# Altium schematic sheet Integrated Connectors.SchDoc
size Letter
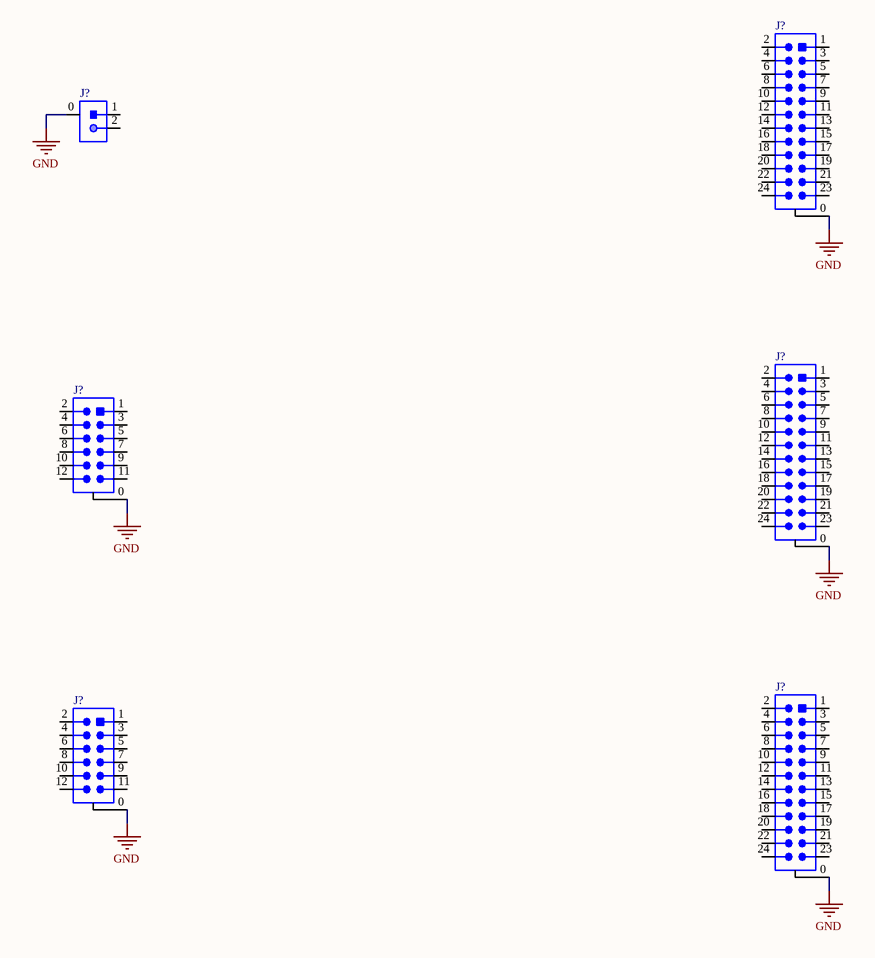
[diagram p0: Integrated Connectors.SchDoc]

## Parts
(Parts that share a designator on the sheet are numbered #1, #2 ... from top to bottom, then left to right.)
J?#1  CON_2M_SM_RA  [MOLEX-5024940270]  (value not drawn)
J?#2  CON_12x2M_SM_RA  [MOLEX-5031482490]  (value not drawn)
J?#3  CON_6x2M_SM_RA  [MOLEX-5031481290]  (value not drawn)
J?#4  CON_12x2M_SM_RA  [MOLEX-5031482490]  (value not drawn)
J?#5  CON_6x2M_SM_RA  [MOLEX-5031481290]  (value not drawn)
J?#6  CON_12x2M_SM_RA  [MOLEX-5031482490]  (value not drawn)

## Nets
GND: J?#1.0 J?#2.0 J?#3.0 J?#4.0 J?#5.0 J?#6.0

Not connected (* = marked no-connect by the designer): J?#1 1 2; J?#2 1 2 3 4 5 6 7 8 9 10 11 12 13 14 15 16 17 18 19 20 21 22 23 24; J?#3 1 2 3 4 5 6 7 8 9 10 11 12; J?#4 1 2 3 4 5 6 7 8 9 10 11 12 13 14 15 16 17 18 19 20 21 22 23 24; J?#5 1 2 3 4 5 6 7 8 9 10 11 12; J?#6 1 2 3 4 5 6 7 8 9 10 11 12 13 14 15 16 17 18 19 20 21 22 23 24

## Notes on the sheet
- Title
- Size:
- Date:
- Letter
- Drawn By:
- Sheet
- of
- File:

## Library data of the parts
J?#1 = CON_2M_SM_RA: CONN HEADER SMD RIGHT ANGLE 2MM PITCH; Manufacturer 1: Molex; Manufacturer Part Number 1: 5024940270; Connector Type: Receptacle,Forked; Number of Positions: 2; Supplier 1: Digi-Key; Stock 1: 3397; Pricing 1: 1=0.53000, 10=0.49400, 25=0.44440, 50=0.39500, 100=0.37850, 250=0.34556 (USD); RoHS: No; Mount: Surface Mount; Contact Plating: Tin; Insulation Color: Natural; Insulation Material: Resin; Min Operating Temperature: -40°C; Max Operating Temperature: 105°C; Fastening Type: Latch; Packaging: Tape and Reel; Number of Rows: 1; Termination: Solder; Flammability Rating: UL94 V-0; ComponentLink1URL: https://www.molex.com/pdm_docs/as/AS-502439-002-001.pdf?src-supplier=Digi-Key; ComponentLink1Description: https://www.molex.com/pdm_docs/as/AS-502439-002-001.pdf?src-supplier=Digi-Key; Supplier Part Number 1: WM15810CT-ND
J?#2 J?#4 J?#6 = CON_12x2M_SM_RA: CONN HEADER SMD RIGHT ANGLE 1.5MM PITCH
J?#3 J?#5 = CON_6x2M_SM_RA: CONN HEADER SMD RIGHT ANGLE 1.5MM PITCH; Manufacturer 1: Molex; Manufacturer Part Number 1: 5031481290; Number of Circuits: 12; Voltage Rating: 100V; Current Rating: 1A; Connector Type: Receptacle,Center Strip Contact; Gender: Receptacle; Glow Wire Compliant: Non-compliant; Supplier 1: Digi-Key; Stock 1: 276; Pricing 1: 1=1.86000, 10=1.68800, 100=1.44720 (USD); RoHS: Yes; Mount: Surface Mount,Through Hole; Contact Plating: Tin; Contact Material: Copper Alloy,Copper,Tin; Housing Color: Beige; Color: Beige; Housing Material: Resin; Min Operating Temperature: -25°C; Max Operating Temperature: 85°C; Packaging: Tape and Reel; Orientation: Right Angle; Number of Rows: 2; Package Quantity: 550; Fastening Type: Latch; Contact Gender: Female; Number of Positions: 12; Termination: Solder; Number of Contacts: 12; Length: 13.3mm; Pitch: 1.5mm; Depth: 9.55mm; Radiation Hardening: No; REACH SVHC: Unknown; ComponentLink1URL: https://datasheet.ciiva.com/756/5031481090-sd-756828.pdf?src-supplier=Digi-Key; ComponentLink1Description: https://datasheet.ciiva.com/756/5031481090-sd-756828.pdf?src-supplier=Digi-Key; ComponentLink2URL: https://datasheet.ciiva.com/10083/5031481290-pcb-receptacles-10083012.pdf?src-supplier=Avnet; ComponentLink2Description: https://datasheet.ciiva.com/10083/5031481290-pcb-receptacles-10083012.pdf?src-supplier=Avnet; ComponentLink3URL: https://datasheet.ciiva.com/30261/68305031481290-pcb-receptacles-30261716.pdf?src-supplier=Onlinecomponents.com; ComponentLink3Description: https://datasheet.ciiva.com/30261/68305031481290-pcb-receptacles-30261716.pdf?src-supplier=Onlinecomponents.com; ComponentLink4URL: https://datasheet.ciiva.com/5162/5031481290-pcb-receptacles-179578-5162271.pdf?src-supplier=Mouser; ComponentLink4Description: https://datasheet.ciiva.com/5162/5031481290-pcb-receptacles-179578-5162271.pdf?src-supplier=Mouser; ComponentLink5URL: https://datasheet.ciiva.com/14155/503148-eng-tds-14155950.pdf?src-supplier=Distrelec; ComponentLink5Description: https://datasheet.ciiva.com/14155/503148-eng-tds-14155950.pdf?src-supplier=Distrelec; Supplier Part Number 1: WM14476CT-ND